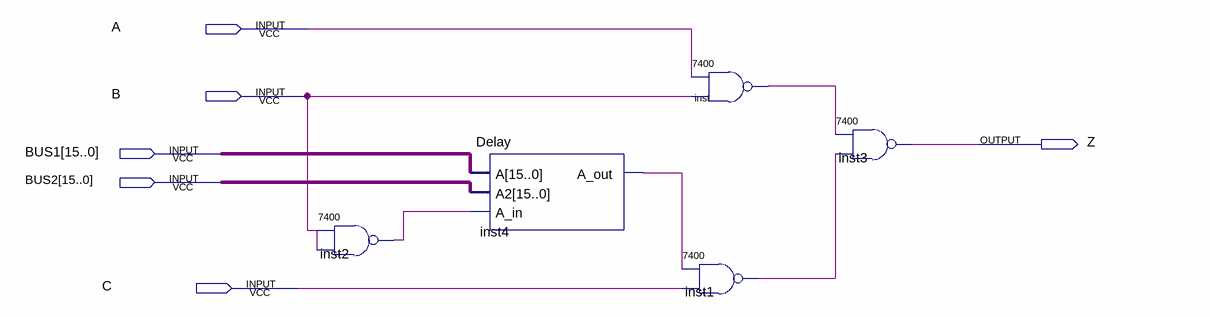
[diagram p0: schematic sheet]
// Quartus schematic Prelab_delay.bdf as structural Verilog: 5 symbols, 6 pins
module Prelab_delay (
  input  A,
  input  B,
  input  [15:0] BUS1,
  input  [15:0] BUS2,
  input  C,
  output Z
);

  wire inst1_1, inst2_1, inst4_a_out, inst_1;

  \7400  inst2 (.\3 (B), .\2 (B), .\1 (inst2_1));
  Delay inst4 (.A(BUS1), .A2(BUS2), .A_in(inst2_1), .A_out(inst4_a_out));
  \7400  inst (.\3 (B), .\2 (A), .\1 (inst_1));
  \7400  inst1 (.\3 (C), .\2 (inst4_a_out), .\1 (inst1_1));
  \7400  inst3 (.\3 (inst1_1), .\2 (inst_1), .\1 (Z));
endmodule
